# Altium schematic sheet powermeter_power_supply.SchDoc: APTOMAT - Power Supply
size A3; Revision: 1.1.1; SheetNumber: 5; SheetTotal: 5; DrawnBy: KJP; ProjectNumber: 4397; PCBRevision: 0071KJP; DocumentSize: A4; PCAName: PCA10040; PCBNumber: 400150; ProjectName: Quark
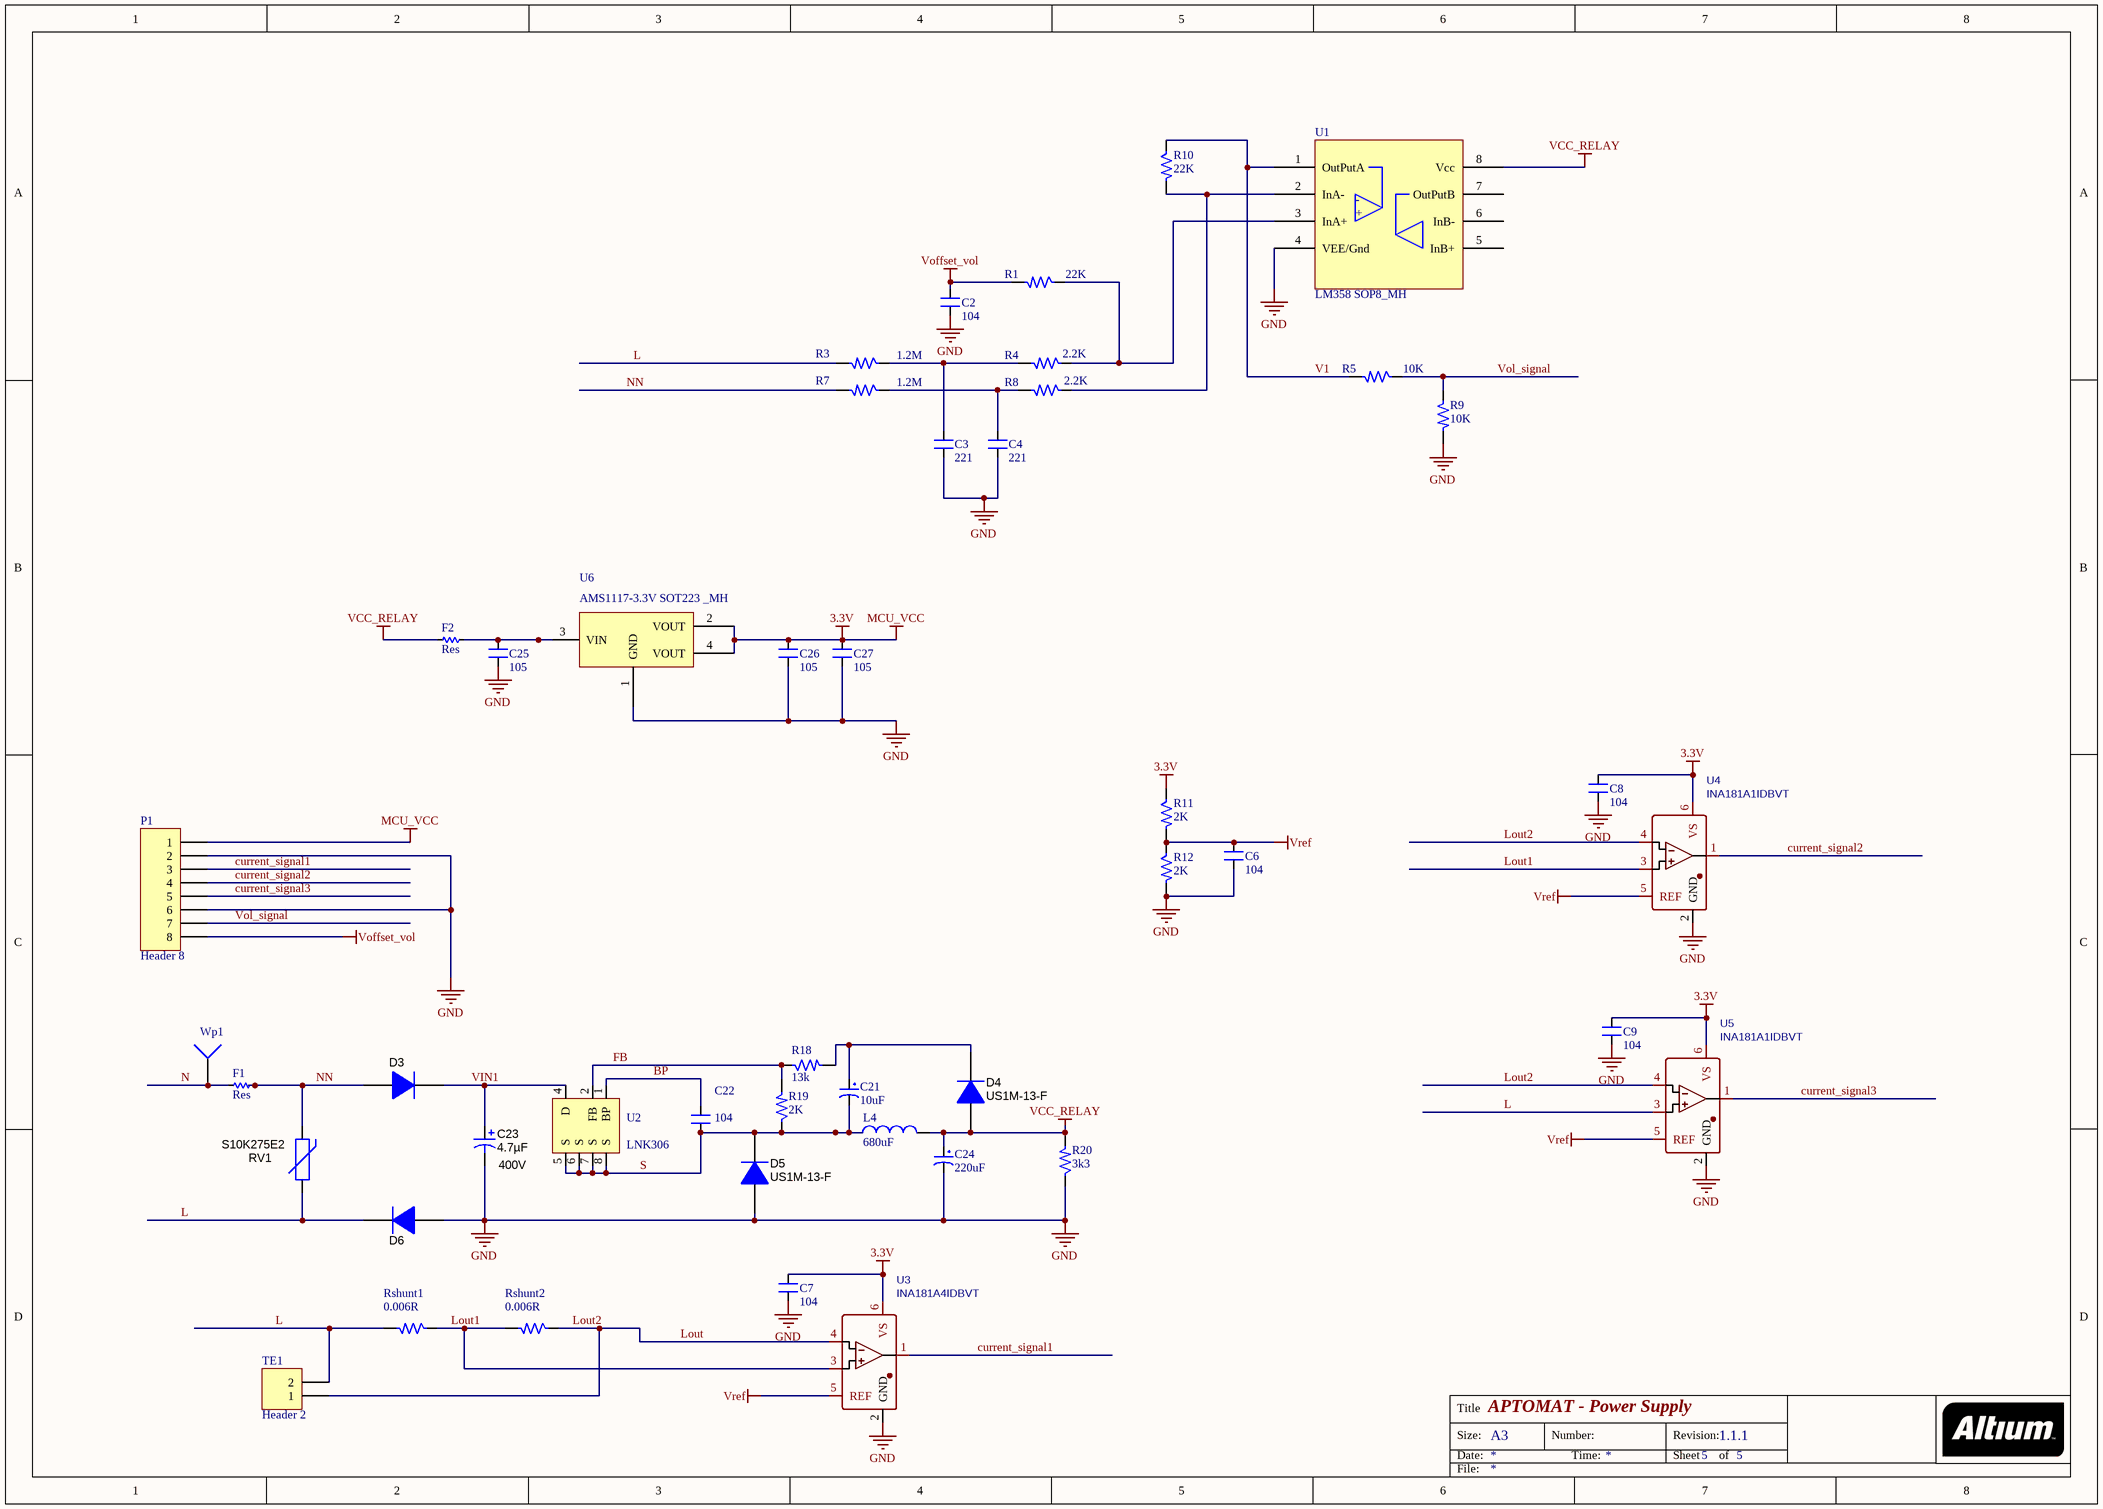
[diagram p0: powermeter_power_supply.SchDoc]

## Parts
C2  104  [0805_HV]
C3  221  [0805_HV]
C4  221  [0805_HV]
C6  104  [0805_HV]
C7  104  [0805_HV]
C8  104  [0805_HV]
C9  104  [0805_HV]
C21  10uF  [TU_NHOM_10uF_MH]
C22  104  [0805_HV]
C23  ValueDisplayed: 4.7µF  Value2: 400V  [PANACAP-G-GENERIC]  (hidden comment: 400AX6R8M8x11)
C24  220uF  [TU_NHOM_2.5_MH]
C25  105  [0805_HV]
C26  105  [0805_HV]
C27  105  [0805_HV]
D3  US1M-13-F  [SMB]  (value not drawn)
D4  US1M-13-F  [SMB]
D5  US1M-13-F  [SMB]
D6  US1M-13-F  [SMB]  (value not drawn)
F1  Res  [1206]
F2  Res  [1206]
L4  680uF  [Inductor 4.5x5]
P1  Header 8  [CON6_1.5D]
R1  22K  [0805_HV]
R3  1.2M  [1206]
R4  2.2K  [0805_HV]
R5  10K  [0805_HV]
R7  1.2M  [1206]
R8  2.2K  [0805_HV]
R9  10K  [0805_HV]
R10  22K  [0805_HV]
R11  2K  [0805_HV]
R12  2K  [0805_HV]
R18  13k  [0805_HV]
R19  2K  [0805_HV]
R20  3k3  [0805_HV]
Rshunt1  0.006R  [RESC2728]
Rshunt2  0.006R  [RESC2728]
RV1  S10K275E2  [VAR_S10K275E2]
TE1  Header 2  [HDR1X2]
U1  LM358 SOP8_MH  [SOP 8]
U2  LNK306  [SOP 7]
U3  INA181A4IDBVT  [SOT95P280X145-6N]
U4  INA181A1IDBVT  [SOT95P280X145-6N]
U5  INA181A1IDBVT  [SOT95P280X145-6N]
U6  AMS1117-3.3V SOT223 _MH  [SOT223]
Wp1  Socket  [PIN1]  (value not drawn)

## Nets
3.3V: C7.2 C8.2 C9.2 C26.2 C27.2 P1.1 R11.1 U3.6(VS) U4.6(VS) U5.6(VS) U6.2(VOUT) U6.4(VOUT)  [also labelled MCU_VCC]
GND: C2.1 C3.1 C4.1 C6.1 C7.1 C8.1 C9.1 C23.2(-) C24.2 C25.1 C26.1 C27.1 D5.2(A) D6.2(A) P1.2 P1.6 R9.2 R12.2 R20.1 U1.4(VEE/Gnd) U3.2(GND) U4.2(GND) U5.2(GND) U6.1(GND)
VCC_RELAY: C24.1 D4.2(A) F2.2 L4.2 R20.2 U1.8(Vcc)
Voffset_vol: C2.2 P1.8 R1.2
Vref: C6.2 R11.2 R12.1 U3.5(REF) U4.5(REF) U5.5(REF)
BP: C22.2 U2.1(BP)
current_signal1: P1.3 U3.1(OUT)
current_signal2: P1.4 U4.1(OUT)
current_signal3: P1.5 U5.1(OUT)
FB: R18.1 R19.2 U2.2(FB)
L: D6.1(K) R3.2 Rshunt1.2 RV1.1 TE1.2 U5.3(IN+)
Lout: Rshunt2.1 TE1.1 U3.4(IN-) U4.4(IN-) U5.4(IN-)  [also labelled Lout2]
Lout1: Rshunt1.1 Rshunt2.2 U3.3(IN+) U4.3(IN+)
N: F1.2 Wp1.1
NN: D3.2(A) F1.1 R7.2 RV1.2
S: C21.2 C22.1 D5.1(K) L4.1 R19.1 U2.5(S) U2.6(S) U2.7(S) U2.8(S)
V1: R5.2 R10.1 U1.1(OutPutA)
VIN1: C23.1(+) D3.1(K) U2.4(D)
Vol_signal: P1.7 R5.1 R9.1
NetC3_2: C3.2 R3.1 R4.2
NetC4_2: C4.2 R7.1 R8.2
NetC21_1: C21.1 D4.1(K) R18.2
NetC25_2: C25.2 F2.1 U6.3(VIN)
NetR1_1: R1.1 R4.1 U1.3(InA+)
NetR8_1: R8.1 R10.2 U1.2(InA-)

Not connected (* = marked no-connect by the designer): U1 5(InB+) 6(InB-) 7(OutPutB)

## Notes on the sheet
- Title
- Size:
- Date:
- A3
- Number:
- Time:
- Revision:
- Sheet
- of
- File:
- (in symbol LM358 SOP8_MH) -; +

## Library data of the parts
C2-C4 C6-C9 C22 C25-C27 = CM: Cap SMD; Value: 103
C21 = TU_NHOM_10uF_25V_MH: Value: 47uF/16 - 50V; Description 1: 470uF/6,3V - 330uF/10V - 220uF/16V; Description 2: 100uF/25V - 35V - 47uF/50V - 22uF/100V; Description 3: 33uF => 47uF/63V - 1uF => 4,7uF/160V; Description 4: 1uF => 2,2uF/250V - 1uF/350V
C23 = 400AX6R8M8x11: CAP, AL, 6.8uF, 400V, +/-20%, TH; Manufacturer: Rubycon; Polarized: Y; CompType: Capacitor; U/M: EA; Cap_F: 0.0000068; Tolerance_%: 20; Value1: Unknown; VDC_V: 400; TaMin_C: -40; TaMax_C: 105; Cap_Case: 8x11; SymbolVersion: 2008-07-09; Value: 6.8uF; PartNumber: 400AX6R8M8x11; PackageReference: 8x11; RoHS: Y; MountType: TH; Technology: AL; Series: AX; Publisher: Texas Instruments; LatestRevisionDate: 2013-08-02; ComponentLink1Description: Datasheet link; ComponentLink1URL: http://www.rubycon.co.jp/de/catalog/e_pdfs/aluminum/e_ax.pdf
C24 = TU_NHOM_220uF_25V_MH: LINK: https://item.taobao.com/item.htm?spm=a230r.1.14.282.6c612953FsebRk&id=546158429968&ns=1&abbucket=10#detail
D3-D6 = MURS160-13-F: Diode, Ultrafast, 600V, 1A, SMB; Manufacturer: Diodes Inc.; U/M: EA; Vf_V: 1.25; Value2: 1.25V; Io_A: 1; Vr_V: 600; TJmax_C: 150; RJC_CperW: 13; PartNumber: US1M-13-F; CompType: Diode; SymbolVersion: 2008-12-08; MountType: SMT; RoHS: Y; Value: 600V; PackageReference: SMB; Value1: 1A; Type: Ultrafast; Published: 2008-06-26; Publisher: Texas Instruments; LatestRevisionDate: 2013-06-21; ComponentLink1Description: Datasheet link; ComponentLink1URL: http://www.diodes.com/datasheets/ds30130.pdf; Supplier 1: Digi-Key; Supplier 2: Mouser; Supplier 3: Farnell
F1 F2 = Res-SMD: Resistor; Manufacturer: Generic Components; Class: Passive; Published: 08/06/2000; Publisher: Altium Hobart Technology Centre
L4 = Inductor 4.5x5_MH
P1 = Header 8: Header, 8-Pin; LatestRevisionDate: 17-Jul-2002; LatestRevisionNote: Re-released for DXP Platform.; Publisher: Altium Limited
R1 R3-R5 R7-R12 R18-R20 Rshunt1 Rshunt2 = R: Resistor 1/4W; Value: R1/4W - 1K
RV1 = S10K275E2: Varistor 275V RMS 10MM Radial, TH; Manufacturer: EPCOS Inc; SymbolCreator: a0412235; SymbolVersion: 2012-06-04; PartNumber: S10K275E2; MountType: TH; ComponentLink1Description: Datasheet URL; ComponentLink1URL: http://www.epcos.com/inf/70/db/var_08/SIOV_Leaded_AdvanceD.pdf; RoHS: Y; PackageReference: 10mm Radial; Publisher: Texas Instruments; LatestRevisionDate: 2013-02-24; Supplier 1: Digi-Key; Supplier Part Number 1: 495-1433-ND
TE1 = Header 2: Header, 2-Pin; LatestRevisionDate: 17-Jul-2002; LatestRevisionNote: Re-released for DXP Platform.; Publisher: Altium Limited
U2 = Component_1
U3-U5 = INA181: BOM_Manufacturer: Texas Instruments; BOM_Manufacturer Part: INA181A2IDBVT; Contributor: LCSC; BOM_Supplier: LCSC; BOM_Supplier Part: C116200; spicePre: U
Wp1 = Socket: LatestRevisionDate: 17-Jul-2002; LatestRevisionNote: Re-released for DXP Platform.; Publisher: Altium Limited